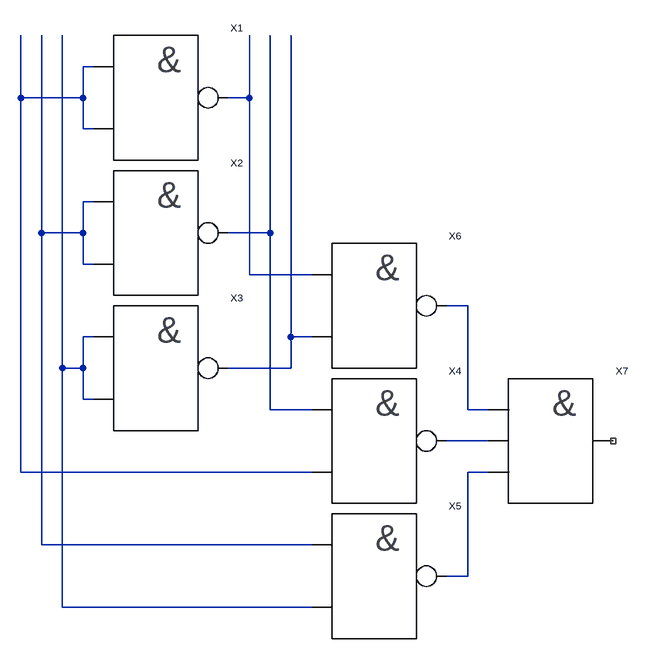
[diagram p0: schematic perep.asc]
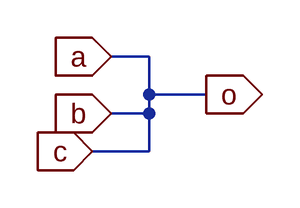
[diagram p1: sub-circuit and3.asc]
perep.asc, the LTspice schematic file:
Version 4
SHEET 1 880 916
WIRE -48 -48 -64 -48
WIRE -160 0 -160 -96
WIRE -64 0 -64 -48
WIRE -64 0 -160 0
WIRE 192 0 192 -96
WIRE 192 0 160 0
WIRE -64 48 -64 0
WIRE -48 48 -64 48
WIRE -48 160 -64 160
WIRE -128 208 -128 -96
WIRE -64 208 -64 160
WIRE -64 208 -128 208
WIRE 224 208 224 -96
WIRE 224 208 160 208
WIRE -64 256 -64 208
WIRE -48 256 -64 256
WIRE 192 272 192 0
WIRE 288 272 192 272
WIRE 528 320 496 320
WIRE -48 368 -64 368
WIRE 256 368 256 -96
WIRE 288 368 256 368
WIRE -96 416 -96 -96
WIRE -64 416 -64 368
WIRE -64 416 -96 416
WIRE 256 416 256 368
WIRE 256 416 160 416
WIRE -64 464 -64 416
WIRE -48 464 -64 464
WIRE 224 480 224 208
WIRE 288 480 224 480
WIRE 528 480 528 320
WIRE 560 480 528 480
WIRE 560 528 496 528
WIRE -160 576 -160 0
WIRE 288 576 -160 576
WIRE 560 576 528 576
WIRE -128 688 -128 208
WIRE 288 688 -128 688
WIRE 528 736 528 576
WIRE 528 736 496 736
WIRE -96 784 -96 416
WIRE 288 784 -96 784
SYMBOL NAND2 48 0 R0
SYMATTR InstName X1
SYMBOL NAND2 48 208 R0
SYMATTR InstName X2
SYMBOL NAND2 48 416 R0
SYMATTR InstName X3
SYMBOL NAND2 384 528 R0
SYMATTR InstName X4
SYMBOL NAND2 384 736 R0
SYMATTR InstName X5
SYMBOL NAND2 384 320 R0
SYMATTR InstName X6
SYMBOL AND3 656 528 R0
SYMATTR InstName X7

and3.asc, the sub-circuit schematic file:
Version 4
SHEET 1 880 680
WIRE 96 80 64 80
WIRE 96 112 96 80
WIRE 144 112 96 112
WIRE 96 128 96 112
WIRE 96 128 64 128
WIRE 96 160 96 128
WIRE 96 160 48 160
FLAG 64 80 a
IOPIN 64 80 In
FLAG 64 128 b
IOPIN 64 128 In
FLAG 144 112 o
IOPIN 144 112 Out
FLAG 48 160 c
IOPIN 48 160 In

The netlist it stands for:
* perep.asc
XX1 N001 N001 N002 NAND2  ; pins a b o
XX2 N003 N003 N004 NAND2  ; pins a b o
XX3 N006 N006 N007 NAND2  ; pins a b o
XX4 N004 N001 N008 NAND2  ; pins a b o
XX5 N003 N006 N009 NAND2  ; pins a b o
XX6 N002 N007 N005 NAND2  ; pins a b o
XX7 N005 N009 NC_01 N008 and3

* block symbol definitions
.subckt and3 a b o c
.ends and3

.backanno
.end